# EAGLE schematic Opencleaner_20150802 (EAGLE 7.3.0)
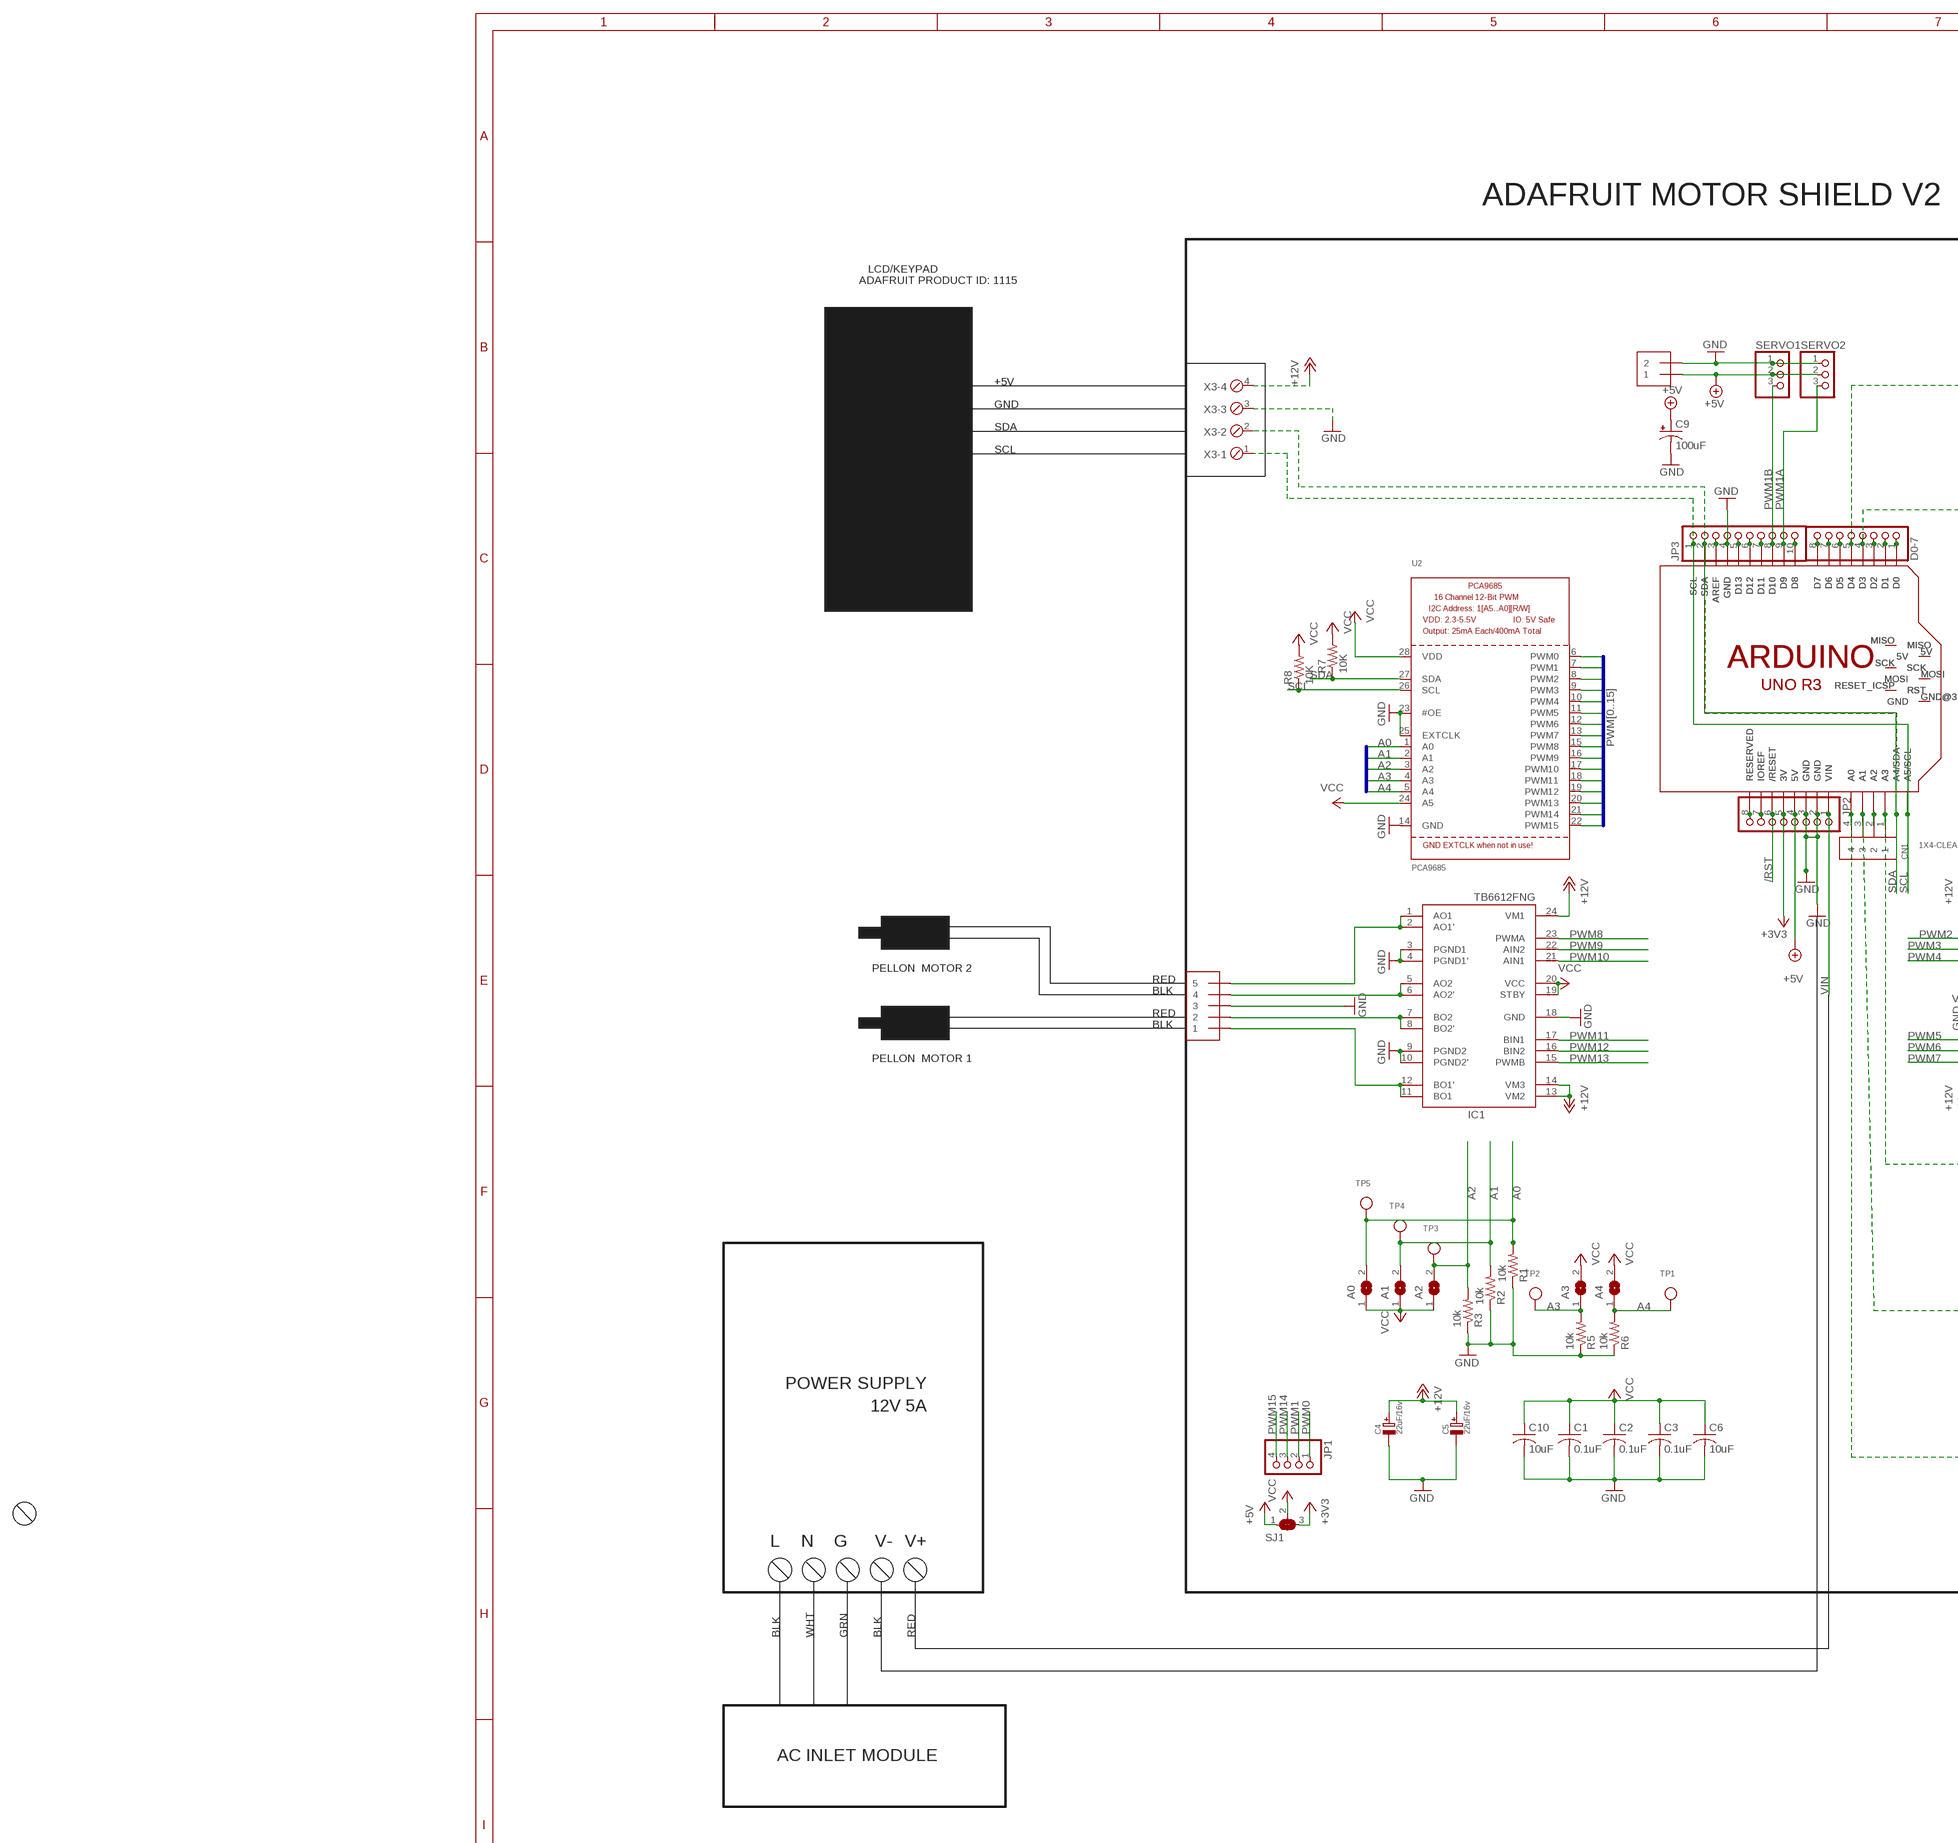
[diagram p0: schematic, sheet 1, part 1 of 2]
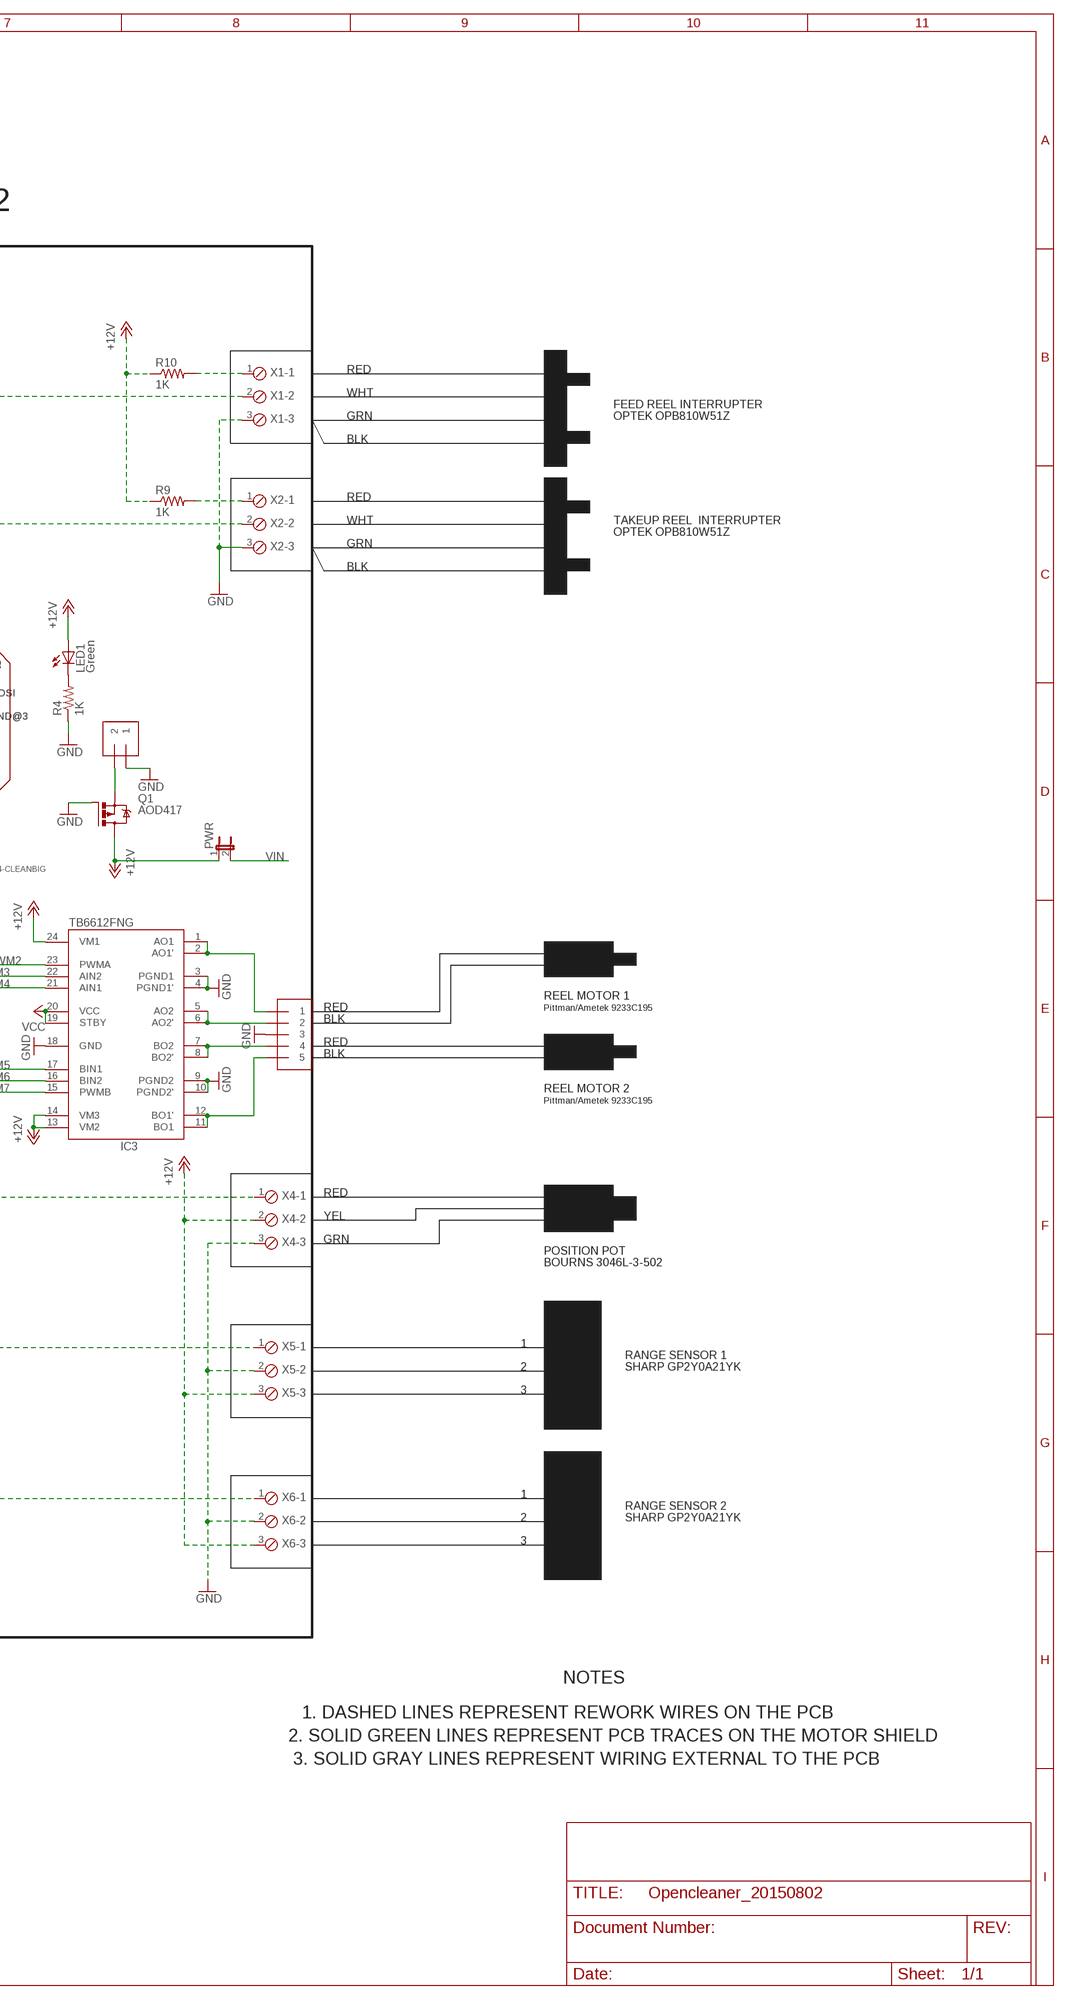
[diagram p1: schematic, sheet 1, part 2 of 2]

## Parts
A0  SJ  [SJ]
A1  SJ  [SJ]
A2  SJ  [SJ]
A3  SJ  [SJ]
A4  SJ  [SJ]
C1  0.1uF  C-USC0805K  [C0805K]
C2  0.1uF  C-USC0805K  [C0805K]
C3  0.1uF  C-USC0805K  [C0805K]
C4  22uF/16v  CAP_ELECTROLYTICPANASONIC_C  [PANASONIC_C]
C5  22uF/16v  CAP_ELECTROLYTICPANASONIC_C  [PANASONIC_C]
C6  10uF  C-USC0805K  [C0805K]
C9  100uF  CPOL-USC  [PANASONIC_C]
C10  10uF  C-USC0805K  [C0805K]
CN1  1X4-CLEANBIG  [1X04-CLEANBIG]
D0-7  PINHD-1X8CLEANBIG  [1X08-CLEANBIG]
IC1  TB6612FNG  [SSOP24]
IC3  TB6612FNG  [SSOP24]
J1  1X5  [1X05-3.5MM]
J2  1X5  [1X05-3.5MM]
JP1  HEADER-1X476MIL  [1X04_ROUND_76]
JP2  PINHD-1X8CLEANBIG  [1X08-CLEANBIG]
JP3  HEADER-1X1070MIL  [1X10_ROUND70]
LED1  Green  LEDCHIP-LED0805  [CHIP-LED0805]
MPOWER  1X2-3.5MM  [1X2-3.5MM]
PWR  JP1E  [JP1]
Q1  AOD417  IRFR5305  [D-PAK_TO252AA]
R1  10k  R-US_R0805  [R0805]
R2  10k  R-US_R0805  [R0805]
R3  10k  R-US_R0805  [R0805]
R4  1K  R-US_R0805  [R0805]
R5  10k  R-US_R0805  [R0805]
R6  10k  R-US_R0805  [R0805]
R7  10K  R-US_R0805  [R0805]
R8  10K  R-US_R0805  [R0805]
R9  1K  R-US_0207/10  [0207/10]
R10  1K  R-US_0207/10  [0207/10]
SERPWR  1X2-3.5MM  [1X2-3.5MM]
SERVO1  PINHD-1X3  [1X03]
SERVO2  PINHD-1X3  [1X03]
SJ1  SOLDERJUMPER_2WAY  [SOLDERJUMPER_2WAY_OPEN_NOPASTE]
TP1  TESTPOINTROUND2MM  [TESTPOINT_ROUND_2MM]
TP2  TESTPOINTROUND2MM  [TESTPOINT_ROUND_2MM]
TP3  TESTPOINTROUND2MM  [TESTPOINT_ROUND_2MM]
TP4  TESTPOINTROUND2MM  [TESTPOINT_ROUND_2MM]
TP5  TESTPOINTROUND2MM  [TESTPOINT_ROUND_2MM]
U2  PCA9685  [TSSOP28]
U$1  ARDUINO_R3_ICSP  [ARDUINOR3_ICSP]
U$5  ARDUINO_R3_ICSP  [ARDUINOR3_ICSP]
X1  MPT3  [3POL254]
X2  MPT3  [3POL254]
X3  MPT4  [4POL254]
X4  MPT3  [3POL254]
X5  MPT3  [3POL254]
X6  MPT3  [3POL254]

## Nets
+3V3: JP2.5 SJ1.3 U$1.3V U$5.3V
+5V: C9.+ JP2.4 SERPWR.1 SERVO1.2 SERVO2.2 SJ1.1 U$1.5V_ICSP(5V) U$5.5V_ICSP(5V)
+12V: C4.+ C5.+ IC1.13(VM2) IC1.14(VM3) IC1.24(VM1) IC3.13(VM2) IC3.14(VM3) IC3.24(VM1) LED1.A PWR.1 Q1.4(D) R9.1 R10.1 X3.4 X4.2 X5.3
/RST: JP2.6 U$1.RESET(/RESET) U$5.RESET(/RESET)
A0: A0.2 R1.2 TP5.P$1 U2.1(A0)
A1: A1.2 R2.2 TP4.P$1 U2.2(A1)
A2: A2.2 R3.2 TP3.P$1 U2.3(A2)
A3: A3.1 R5.2 TP2.P$1 U2.4(A3)
A4: A4.1 R6.2 TP1.P$1 U2.5(A4)
GND: C1.2 C2.2 C3.2 C4.- C5.- C6.2 C9.- C10.2 IC1.3(PGND1) IC1.4(PGND1') IC1.9(PGND2) IC1.10(PGND2') IC1.18(GND) IC3.3(PGND1) IC3.4(PGND1') IC3.9(PGND2) IC3.10(PGND2') IC3.18(GND) J1.3 J2.3 JP2.2 JP2.3 JP3.4 MPOWER.1 Q1.1(G) R1.1 R2.1 R3.1 R4.1 R5.1 R6.1 SERPWR.2 SERVO1.1 SERVO2.1 U2.14(GND) U2.23(#OE) U2.25(EXTCLK) U$1.GND U$1.GND@1(GND) U$1.GND@2(GND) U$5.GND U$5.GND@1(GND) U$5.GND@2(GND) X1.3 X2.3 X3.3 X4.3 X5.2
N$1: JP2.7 U$1.IOREF U$5.IOREF
N$2: JP2.8 U$1.RESERVED U$5.RESERVED
N$3: U$1.MISO U$5.MISO
N$4: IC1.1(AO1) IC1.2(AO1') J1.5
N$5: U$1.5V U$5.5V
N$6: IC1.5(AO2) IC1.6(AO2') J1.4
N$7: IC1.7(BO2) IC1.8(BO2') J1.2
N$8: U$1.MOSI U$5.MOSI
N$9: IC1.11(BO1) IC1.12(BO1') J1.1
N$10: U$1.GND@3(GND) U$5.GND@3(GND)
N$11: U$1.SCK U$5.SCK
N$12: IC3.1(AO1) IC3.2(AO1') J2.1
N$13: U$1.RESET_ICSP(RST) U$5.RESET_ICSP(RST)
N$14: IC3.5(AO2) IC3.6(AO2') J2.2
N$15: IC3.7(BO2) IC3.8(BO2') J2.4
N$16: R9.2 X2.1
N$17: IC3.11(BO1) IC3.12(BO1') J2.5
N$18: R10.2 X1.1
N$20: CN1.4 U$1.A0 U$5.A0
N$21: CN1.3 U$1.A1 U$5.A1
N$22: CN1.2 U$1.A2 U$5.A2
N$23: CN1.1 U$1.A3 U$5.A3 X4.1
N$24: D0-7.1 U$1.D0 U$5.D0
N$25: D0-7.2 U$1.D1 U$5.D1
N$26: D0-7.3 U$1.D2 U$5.D2
N$28: D0-7.8 U$1.D7 U$5.D7
N$29: JP3.10 U$1.D8 U$5.D8
N$30: JP3.6 U$1.D12 U$5.D12
N$31: JP3.5 U$1.D13 U$5.D13
N$32: JP3.3 U$1.AREF U$5.AREF
N$33: D0-7.5 U$1.D4 U$5.D4 X1.2
N$133: LED1.C R4.2
N$140: MPOWER.2 Q1.3(S)
PWM0: JP1.1 U2.6(PWM0)
PWM0A: D0-7.7 U$1.D6 U$5.D6
PWM0B: D0-7.6 U$1.D5 U$5.D5
PWM1: JP1.2 U2.7(PWM1)
PWM1A: JP3.9 SERVO2.3 U$1.D9 U$5.D9
PWM1B: JP3.8 SERVO1.3 U$1.D10 U$5.D10
PWM2: IC3.23(PWMA) U2.8(PWM2)
PWM2A: JP3.7 U$1.D11 U$5.D11
PWM2B: D0-7.4 U$1.D3 U$5.D3 X2.2
PWM3: IC3.22(AIN2) U2.9(PWM3)
PWM4: IC3.21(AIN1) U2.10(PWM4)
PWM5: IC3.17(BIN1) U2.11(PWM5)
PWM6: IC3.16(BIN2) U2.12(PWM6)
PWM7: IC3.15(PWMB) U2.13(PWM7)
PWM8: IC1.23(PWMA) U2.15(PWM8)
PWM9: IC1.22(AIN2) U2.16(PWM9)
PWM10: IC1.21(AIN1) U2.17(PWM10)
PWM11: IC1.17(BIN1) U2.18(PWM11)
PWM12: IC1.16(BIN2) U2.19(PWM12)
PWM13: IC1.15(PWMB) U2.20(PWM13)
PWM14: JP1.3 U2.21(PWM14)
PWM15: JP1.4 U2.22(PWM15)
SCL: JP3.1 R8.1 U2.26(SCL) U$1.A5(A5/SCL) U$1.SCL U$5.A5(A5/SCL) U$5.SCL X3.1
SDA: JP3.2 R7.1 U2.27(SDA) U$1.A4(A4/SDA) U$1.SDA U$5.A4(A4/SDA) U$5.SDA X3.2
VCC: A0.1 A1.1 A2.1 A3.2 A4.2 C1.1 C2.1 C3.1 C6.1 C10.1 IC1.19(STBY) IC1.20(VCC) IC3.19(STBY) IC3.20(VCC) R7.2 R8.2 SJ1.2 U2.24(A5) U2.28(VDD)
VIN: JP2.1 PWR.2 U$1.VIN U$5.VIN
Unconnected: X5.1 X6.1 X6.2 X6.3

## Buses
PWM[0..15]
A[0..4]

## Notes on the sheet
- ADAFRUIT MOTOR SHIELD V2
- LCD/KEYPAD
- ADAFRUIT PRODUCT ID: 1115
- RED
- +5V | WHT
- FEED REEL INTERRUPTER
- GND | GRN | OPTEK OPB810W51Z
- SDA | BLK
- SCL
- RED
- WHT | TAKEUP REEL  INTERRUPTER
- OPTEK OPB810W51Z
- GRN
- BLK
- PELLON  MOTOR 2 | REEL MOTOR 1
- RED | RED | Pittman/Ametek 9233C195
- BLK | BLK
- RED | RED
- BLK | BLK
- PELLON  MOTOR 1 | REEL MOTOR 2
- Pittman/Ametek 9233C195
- RED
- YEL
- GRN
- POSITION POT
- BOURNS 3046L-3-502
- 1
- RANGE SENSOR 1
- 2 | SHARP GP2Y0A21YK
- 3
- POWER SUPPLY
- 12V 5A
- 1
- RANGE SENSOR 2
- 2 | SHARP GP2Y0A21YK
- 3
- L | N | G | V- | V+
- BLK | WHT | GRN | BLK | RED | NOTES
- 1. DASHED LINES REPRESENT REWORK WIRES ON THE PCB
- 2. SOLID GREEN LINES REPRESENT PCB TRACES ON THE MOTOR SHIELD
- 3. SOLID GRAY LINES REPRESENT WIRING EXTERNAL TO THE PCB
- AC INLET MODULE

## Library data of the parts
A0 A1-A4 = jumper:SJ: SMD solder JUMPER
C1-C3 C6 C10 = adafruit:C-US: CAPACITOR, American symbol
C4 C5 = microbuilder:CAP_ELECTROLYTIC: Electrolytic Capacitors SMT PANASONIC_C - Size C Panasonic Electrolytic Aluminum Capacitor 47µF 16V 20% Electrolytic Capacitor [Digikey: PCE3890TR-ND] PANASONIC_D - Size D Panasonic Electrolytic Aluminum Capacitor 100µF 25V 20% Electrolytic Capacitor [Digikey: PCE3898TR-ND] PTH 3.5 mm grid, 8 mm diameter ... 3.5 mm grid, 10 mm diameter ...
C9 = adafruit:CPOL-US: POLARIZED CAPACITOR, American symbol
CN1 = adafruit:1X4: 4-pin connector
D0-7 JP2 = adafruit:PINHD-1X8: PIN HEADER
IC1 IC3 = adafruit:TB6612FNG: TB6612FNG MOS dual H-bridge motor driver, 1.2A current 3.2A peak 3 or 5v logic and 3-15v motor
J1 J2 = adafruit:1X5
JP1 = microbuilder:HEADER-1X4: PIN HEADER
JP3 = microbuilder:HEADER-1X10: PIN HEADER
LED1 = adafruit:LED: LED OSRAM: - CHIPLED LG R971, LG N971, LY N971, LG Q971, LY Q971, LO R971, LY R971 LH N974, LH R974 LS Q976, LO Q976, LY Q976 LO Q996 - Hyper CHIPLED LW Q18S LB Q993, LB Q99A, LB R99A - SideLED LS A670, LO A670, LY A670, LG A670, LP A670 LB A673, LV A673, LT A673, LW A673 LH A674 LY A675 LS A676, LA A676, LO A676, LY A676, LW A676 LS A679, LY A679, LG A679 - Hyper Micro SIDELED® LS Y876, LA Y876, LO Y876, LY Y876 LT Y87S - SmartLED LW L88C, LW L88S LB L89C, LB L89S, LG L890 LS L89K, LO L89K, LY L89K LS L896, LA L896, LO L896, LY L896 - TOPLED LS T670, LO T670, LY T670, LG T670, LP T670 LSG T670, LSP T670, LSY T670, LOP T670, LYG T670 LG T671, LOG T671, LSG T671 LB T673, LV T673, LT T673, LW T673 LH T674 LS T676, LA T676, LO T676, LY T676, LB T676, LH T676, LSB T676, LW T676 LB T67C, LV T67C, LT T67C, LS T67K, LO T67K, LY T67K, LW E67C LS E67B, LA E67B, LO E67B, LY E67B, LB E67C, LV E67C, LT E67C LW T67C LS T679, LY T679, LG T679 LS T770, LO T770, LY T770, LG T770, LP T770 LB T773, LV T773, LT T773, LW T773 LH T774 LS E675, LA E675, LY E675, LS T675 LS T776, LA T776, LO T776, LY T776, LB T776 LHGB T686 LT T68C, LB T68C - Hyper Mini TOPLED® LB M676 - Mini TOPLED Santana® LG M470 LS M47K, LO M47K, LY M47K Source: http://www.osram.convergy.de/
MPOWER SERPWR = adafruit:1X2: 3.5mm Terminal block http://www.ladyada.net/library/pcb/eaglelibrary.html
PWR = jumper:JP1E: JUMPER
Q1 = transistor-power:IRF?5305: HEXFET Power MOSFET Source: http://www.irf.com/product-info/datasheets/data/irfr5305pbf.pdf
R1-R8 = adafruit:R-US_: RESISTOR, American symbol
R9 R10 = BLDC PUMP:R-US_: RESISTOR, American symbol
SERVO1 SERVO2 = adafruit:PINHD-1X3: PIN HEADER
SJ1 = microbuilder:SOLDERJUMPER_2WAY: 2-Way Solder Jumper
TP1-TP5 = microbuilder:TESTPOINT: Test Point Various test points for characterisation and PCB testing TESTPOINT_SMT - Compact Surface Mount Test Point [Digikey: 5016KTR-ND]
U2 = microbuilder:PCA9685: PCA9685 - 16 Channel 12-Bit I2C PWM Controller 5.0V tolerant 16 channel, 12-bit I2C PWM controller with 25mA per output (max. 400mA total) Digikey: 568-5931-1-ND
U$1 U$5 = adafruit:ARDUINO_R3_ICSP
X1 X2 X4-X6 = con-phoenix-254:MPT3: PHOENIX CONNECTOR; OC_FARNELL: unknown; OC_NEWARK: unknown
X3 = con-phoenix-254:MPT4: PHOENIX CONNECTOR; OC_FARNELL: unknown; OC_NEWARK: unknown